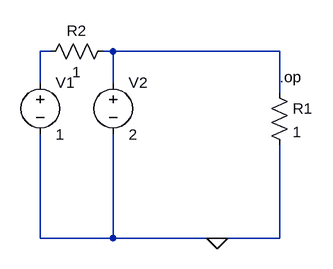
[diagram p0: schematic 2VSource_2R_version2.asc]
2VSource_2R_version2.asc, the LTspice schematic file:
Version 4
SHEET 1 880 680
WIRE 32 128 16 128
WIRE 128 128 112 128
WIRE 384 128 128 128
WIRE 16 176 16 128
WIRE 128 176 128 128
WIRE 384 192 384 128
WIRE 16 416 16 256
WIRE 128 416 128 256
WIRE 128 416 16 416
WIRE 288 416 128 416
WIRE 384 416 384 272
WIRE 384 416 288 416
FLAG 288 416 0
SYMBOL voltage 128 160 R0
SYMATTR InstName V2
SYMATTR Value 2
SYMBOL res 368 176 R0
SYMATTR InstName R1
SYMATTR Value 1
SYMBOL voltage 16 160 R0
SYMATTR InstName V1
SYMATTR Value 1
SYMBOL res 128 112 R90
WINDOW 0 0 56 VBottom 2
WINDOW 3 32 56 VTop 2
SYMATTR InstName R2
SYMATTR Value 1
TEXT 384 168 Left 2 !.op

The netlist it stands for:
* 2VSource_2R_version2.asc
V2 N002 0 2
R1 N002 0 1
V1 N001 0 1
R2 N002 N001 1
.op
.backanno
.end